# Altium schematic sheet Power.SchDoc
size A4
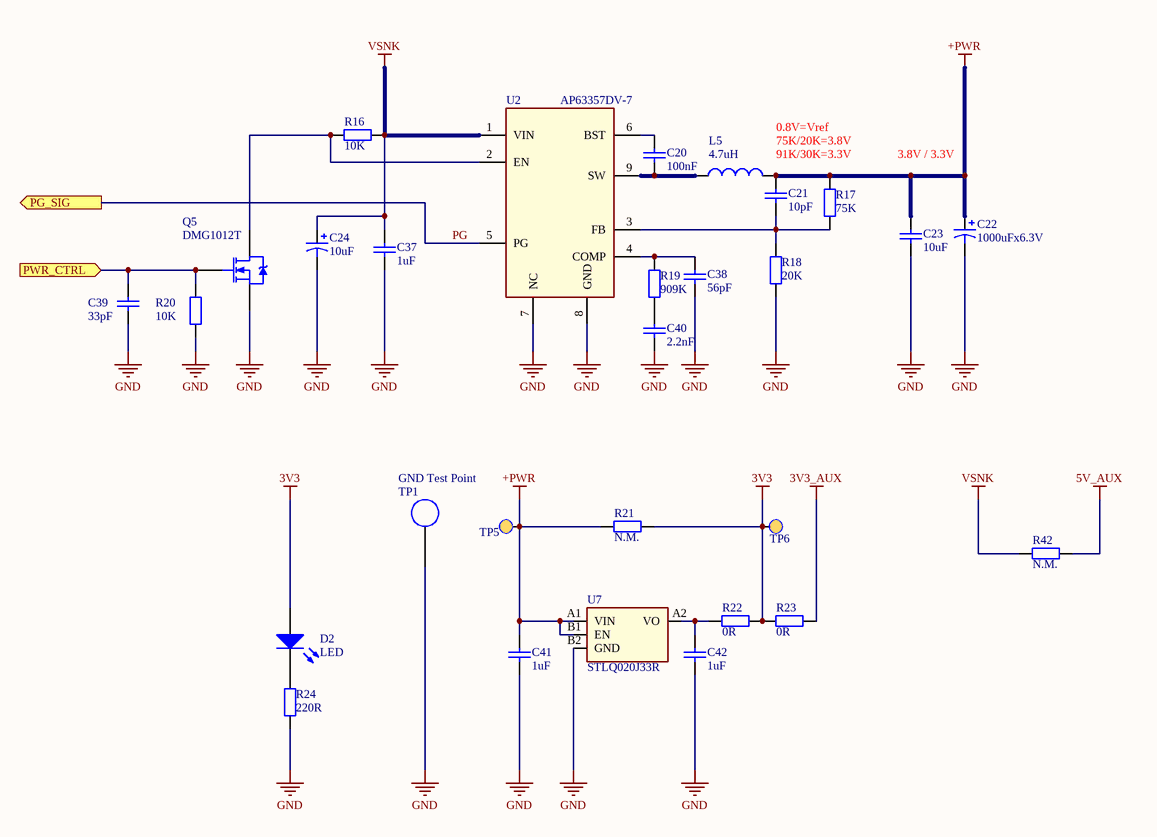
[diagram p0: Power.SchDoc]

## Parts
C20  value 100nF  [C0402]  (hidden comment: Cap Semi)
C21  value 10pF  [C0402]  (hidden comment: Cap Semi)
C22  value 1000uFx6.3V  [7361-38]  (hidden comment: electrolytic capacitor)
C23  value 10uF  [C0402]  (hidden comment: Cap Semi)
C24  value 10uF  [Case-B]  (hidden comment: electrolytic capacitor)
C37  value 1uF  [C0402]  (hidden comment: Cap Semi)
C38  value 56pF  [C0402]  (hidden comment: Cap Semi)
C39  value 33pF  [C0402]  (hidden comment: Cap Semi)
C40  value 2.2nF  [C0402]  (hidden comment: Cap Semi)
C41  value 1uF  [C0402]  (hidden comment: Cap Semi)
C42  value 1uF  [C0402]  (hidden comment: Cap Semi)
D2  LED  [PICOLED]
L5  value 4.7uH  [CHILSIN_5.4x5.7]  (hidden comment: Inductor)
Q5  DMG1012T  [SOT-523_custom]
R16  value 10K  [R0402]  (hidden comment: Res2)
R17  value 75K  [R0402]  (hidden comment: Res2)
R18  value 20K  [R0402]  (hidden comment: Res2)
R19  value 909K  [R0402]  (hidden comment: Res2)
R20  value 10K  [R0402]  (hidden comment: Res2)
R21  value N.M.  [R0402]  (hidden comment: Res2)  (no BOM)
R22  value 0R  [R0402]  (hidden comment: Res2)
R23  value 0R  [R0402]  (hidden comment: Res2)
R24  value 220R  [R0402]  (hidden comment: Res2)
R42  value N.M.  [R1206]  (hidden comment: Res2)  (no BOM)
TP1  GND Test Point  [5019_keystone]
TP5  Test_Point  [TEST_POINT]  (value not drawn)  (no BOM)
TP6  Test_Point  [TEST_POINT]  (value not drawn)  (no BOM)
U2  AP63357DV-7  [V-DFN3020-13]
U7  STLQ020J33R  [Flip-Chip4]

## Ports
PG_SIG (out), PWR_CTRL (in)

## Nets
3V3: D2.1(A) R21.1 R22.1 R23.2 TP6.0
3V3_AUX: R23.1
5V_AUX: R42.1
+PWR: C21.2 C22.1 C23.2 C41.1 L5.2 R17.1 R21.2 TP5.0 U7.A1(VIN) U7.B1(EN)
GND: C22.2 C23.1 C24.2 C37.1 C38.1 C39.2 C40.1 C41.2 C42.2 Q5.3(S) R18.2 R20.1 R24.2 TP1.1 U2.7(NC) U2.8(GND) U7.B2(GND)
VSNK: C24.1 C37.2 R16.2 R42.2 U2.1(VIN)
PG: U2.5(PG) ; port PG_SIG
PWR_CTRL: C39.1 Q5.1(G) R20.2 ; port PWR_CTRL
NetC20_1: C20.1 U2.6(BST)
NetC20_2: C20.2 L5.1 U2.9(SW)
NetC21_1: C21.1 R17.2 R18.1 U2.3(FB)
NetC38_2: C38.2 R19.1 U2.4(COMP)
NetC40_2: C40.2 R19.2
NetC42_1: C42.1 R22.2 U7.A2(VO)
NetD2_2: D2.2(K) R24.1
NetQ5_2: Q5.2(D) R16.1 U2.2(EN)

## Notes on the sheet
- 0.8V=Vref
- 91K/30K=3.3V
- 75K/20K=3.8V
- 3.8V / 3.3V

## Library data of the parts
C20 = Cap Semi: Capacitor (Semiconductor SIM Model); Manufacturer: YAGEO; Manufacturer Part No.: CC0402KRX7R9BB104; Part Description: Ceramic Capacitor; Specification: X7R, 50V, 10%; Supplier: Rutronik; Supplier part number: KKK23619; Link: https://www.rutronik24.com/search-result/qs:KKK23619/reset:0
C21 = Cap Semi: Capacitor (Semiconductor SIM Model); Manufacturer: YAGEO; Manufacturer Part No.: CC0402JRNPO9BN100; Part Description: Ceramic Capacitor; Specification: NP0, 50V, 5%; Supplier: Rutronik; Supplier part number: KKK14556; Link: https://www.rutronik24.com/product/yageo/cc0402jrnpo9bn100/29735.html
C22 = Cap Pol1: Manufacturer: AVX; Manufacturer Part No.: TPSV108M006R0050; Part Description: Tantalum Capacitor; Specification: 6,3V 20%; Supplier: Rutronik; Supplier part number: TPSV108M006R0050; Link: https://www.rutronik24.com/product/avx/tpsv108m006r0050/11647835.html
C23 = Cap Semi: Capacitor (Semiconductor SIM Model); Manufacturer: Samsung Electronics; Manufacturer Part No.: CL05A106MP5NUNC; Part Description: Ceramic Capacitor; Specification: X5R, 10V, 20%; Supplier: Rutronik; Supplier part number: KKS2857; Link: https://www.rutronik24.com/search-result/qs:KKS2857/reset:0
C24 = Cap Pol1: Manufacturer: AVX; Manufacturer Part No.: TCJB106M025R0100; Part Description: Tantalum Polymer Capacitor; Specification: Ta Poly, 25V, 20%; Supplier: Rutronik; Supplier part number: TCJB106M025R0100; Link: https://www.rutronik24.com/product/avx/tcjb106m025r0100/11642835.html
C37 C41 C42 = Cap Semi: Capacitor (Semiconductor SIM Model); Manufacturer: muRata; Manufacturer Part No.: GRM155R61E105KA12D; Part Description: Ceramic Capacitor; Specification: X5R, 25V, 10%; Supplier: Rutronik; Supplier part number: KKS4987; Link: https://www.rutronik24.com/product/murata/grm155r61e105ka12d/4725132.html
C38 = Cap Semi: Capacitor (Semiconductor SIM Model); Manufacturer: YAGEO; Manufacturer Part No.: CC0402JRNPO9BN560; Part Description: Ceramic Capacitor; Specification: NP0, 50V, 5%; Supplier: Rutronik; Supplier part number: KKK13529; Link: https://www.rutronik24.com/product/yageo/cc0402jrnpo9bn560/29436.html
C39 = Cap Semi: Capacitor (Semiconductor SIM Model); Manufacturer: AVX; Manufacturer Part No.: 04025A330JAT2A; Part Description: Ceramic Capacitor; Specification: NP0, 50V, 5%; Supplier: Rutronik; Supplier part number: KKK13594; Link: https://www.rutronik24.com/product/avx/04025a330jat2a/3692730.html
C40 = Cap Semi: Capacitor (Semiconductor SIM Model); Manufacturer: YAGEO; Manufacturer Part No.: CC0402KPX7R9BB222; Part Description: Ceramic Capacitor; Specification: X7R, 50V, 10%; Supplier: Rutronik; Supplier part number: KKK20885; Link: https://www.rutronik24.com/search-result/qs:KKK20885/reset:0
D2 = LED2: Typical SMD LED; Manufacturer: OSRAM; Manufacturer Part No.: LTQH9G-Q2OO-25-2Z4Y-5-R18; Specification: Green, 5mA; Value: LTQH9G-Q2OO-25-2Z4Y-5-R18; Supplier: Rutronik; Supplier part number: LED22816; Part Description: Typical SMD LED; Link: https://www.rutronik24.com/product/osram/ltqh9g-q2oo-25-2z4y-5-r18/7461152.html
L5 = Inductor: Manufacturer: CHILISIN; Manufacturer Part No.: BMRA000505204R7MA1; Specification: 3A, 20%; Supplier: Rutronik; Supplier part number: BMRA000505204R7MA1; Part Description: Inductor; Link: https://www.chilisin.com/en-global/Inductor/Product/BMRA_050520/BMRA000505204R7MA1
Q5 = NMOS-2: N-Channel Power MOSFET; Manufacturer: Diodes Inc.; Manufacturer Part No.: DMG1012T-7; Part Description: N-Channel MOSFET; Specification: 20V, 0.63A; Value: DMG1012T-7; Supplier: Rutronik; Supplier part number: TMOSS6623; Link: https://www.rutronik24.com/product/diodes+inc/dmg1012t-7/5168665.html
R16 R20 = Res2: Manufacturer: ASJ; Manufacturer Part No.: CR10-103-JK; Part Description: Thick Film Resistor; Specification: 5% 0,063W; Supplier: Rutronik; Supplier part number: WRC40976; Link: https://www.rutronik24.com/product/asj/cr10-103-jk/54295.html
R17 = Res2: Manufacturer: YAGEO; Manufacturer Part No.: RC0402JR-0775KL; Part Description: Thick Film Resistor; Specification: 5% 0,063W; Supplier: Rutronik; Supplier part number: WRC33884; Link: https://www.rutronik24.com/category-type/standard-chip-resistor/rchip-0402-5/move:0/resistor-value:75K
R18 = Res2: Manufacturer: YAGEO; Manufacturer Part No.: AC0402JR-0720KL; Part Description: Thick Film Resistor; Specification: 5% 0,063W; Supplier: Rutronik; Supplier part number: WRC53108; Link: https://www.rutronik24.com/product/yageo/ac0402jr-0720kl/1920796.html
R19 = Res2: Manufacturer: ASJ; Manufacturer Part No.: RC0402FR-07909KL; Part Description: Thick Film Resistor; Specification: 5% 0,063W; Supplier: Rutronik; Supplier part number: WRC34086; Link: https://www.rutronik24.com/category-type/standard-chip-resistor/rchip-0402-1/move:0/resistor-value:909K
R21-R23 R42 = Res2: Manufacturer: YAGEO; Manufacturer Part No.: RC0402FR-070RL; Part Description: Thick Film Resistor; Specification: 5% 0,063W; Supplier: Rutronik; Supplier part number: WRC53079; Link: https://www.rutronik24.com/product/yageo/rc0402fr-070rl/5183530.html
R24 = Res2: Manufacturer: ASJ; Manufacturer Part No.: CR10-221-JK; Part Description: Thick Film Resistor; Specification: 5% 0,063W; Supplier: Rutronik; Supplier part number: WRC35108; Link: https://www.rutronik24.com/product/asj/cr10-221-jk/51883.html
TP1 = 5019: SMD Test Point; Manufacturer: Keystone Electrincs; Part Description: SMT Test Point; Specification: 3.81*2.03; Value: 5019; Manufacturer Part No.: 5019; Supplier: Rutronik; Supplier part number: BAT4950; Link: https://www.rutronik24.com/product/keystone/pn5019/7028403.html
TP5 TP6 = Test_Point: Test Point
U2 = AP63356: 3.8V TO 32VINPUT, 3.5A Low IQ Synchronous Buck with Enhanced EMI Reduction; Manufacturer: Diodes Inc.; Specification: 32V, 3.5A; Link: https://www.diodes.com/search/?q=AP63357DV-7+&t=keyword&action_results=Go; Manufacturer Part No.: AP63357DV-7; Part Description: 3.8V TO 32VINPUT, 3.5A Low IQ Synchronous Buck with Enhanced EMI Reduction; Supplier: Rutronik; Supplier part number: AP63357DV-7; Value: AP63357DV-7
U7 = STLQ020: LDO; Manufacturer: STMicroelectronics; Part Description: 200 mA ultra-low quiescent current LDO; Specification: 3.3V, 200mA; Manufacturer Part No.: STLQ020J33R; Supplier: Rutronik; Supplier part number: STLQ020J33R; Value: STLQ020J33R; Link: https://www.rutronik24.com/search-result/qs:STLQ020J33R/reset:0